# EasyEDA schematic HW1_22.json
TITLE: Sheet_1; REV: 1.0; Date: 2020-11-04; Sheet: 1/1; Drawn By: gokbeykeskin_4066; Company: Your Company
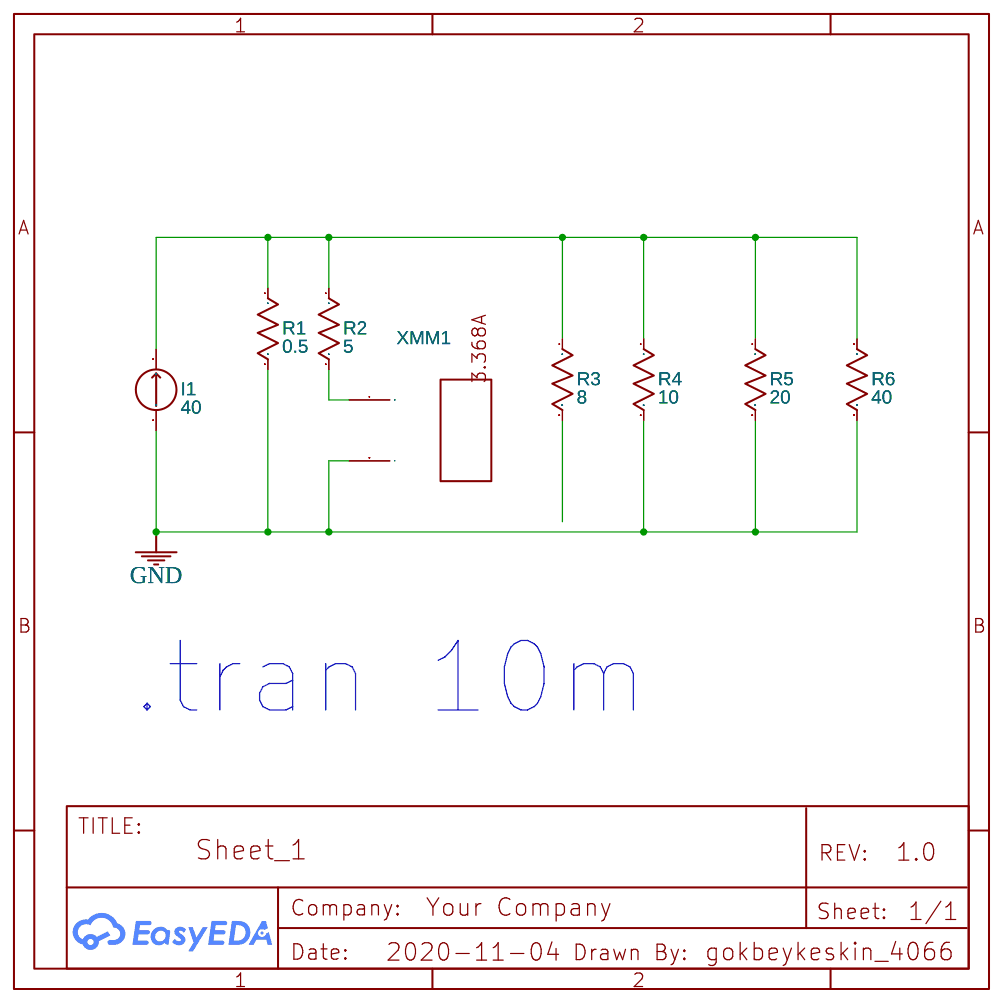
[diagram p0: schematic sheet]

## Parts
I1  40  [2P-5.08]
R1  0.5  [AXIAL-0.3]
R2  5  [AXIAL-0.3]
R3  8  [AXIAL-0.3]
R4  10  [AXIAL-0.3]
R5  20  [AXIAL-0.3]
R6  40  [AXIAL-0.3]
XMM1  Multimeter

## Library data of the parts
I1 = IDC: Contributor: EasyEDA; sim: true
R1-R6 = Resistor_US: Resistance: 1k; Contributor: EasyEDA; Supplier: YUJING
XMM1 = MULTIMETER: Supplier: LCSC; Multimeter Type: Amper; Power Type: AC; Voltmeter resistance: 10μ; Ammeter resistance: 1G; NameDisplay: 0; Contributor: EasyEDA; sim: true

## Nets
GND: I1.1 R1.2 R4.2 R5.2 R6.2 XMM1.2(I)
Net-(I1-2): I1.2 R1.1 R2.1 R3.1 R4.1 R5.1 R6.1
Net-(R2-2): R2.2 XMM1.1(+)

Not connected (* = marked no-connect by the designer): R3 2

## Notes on the sheet
- .tran 10m
